# Altium schematic sheet Connectors.SchDoc
size OrCAD A
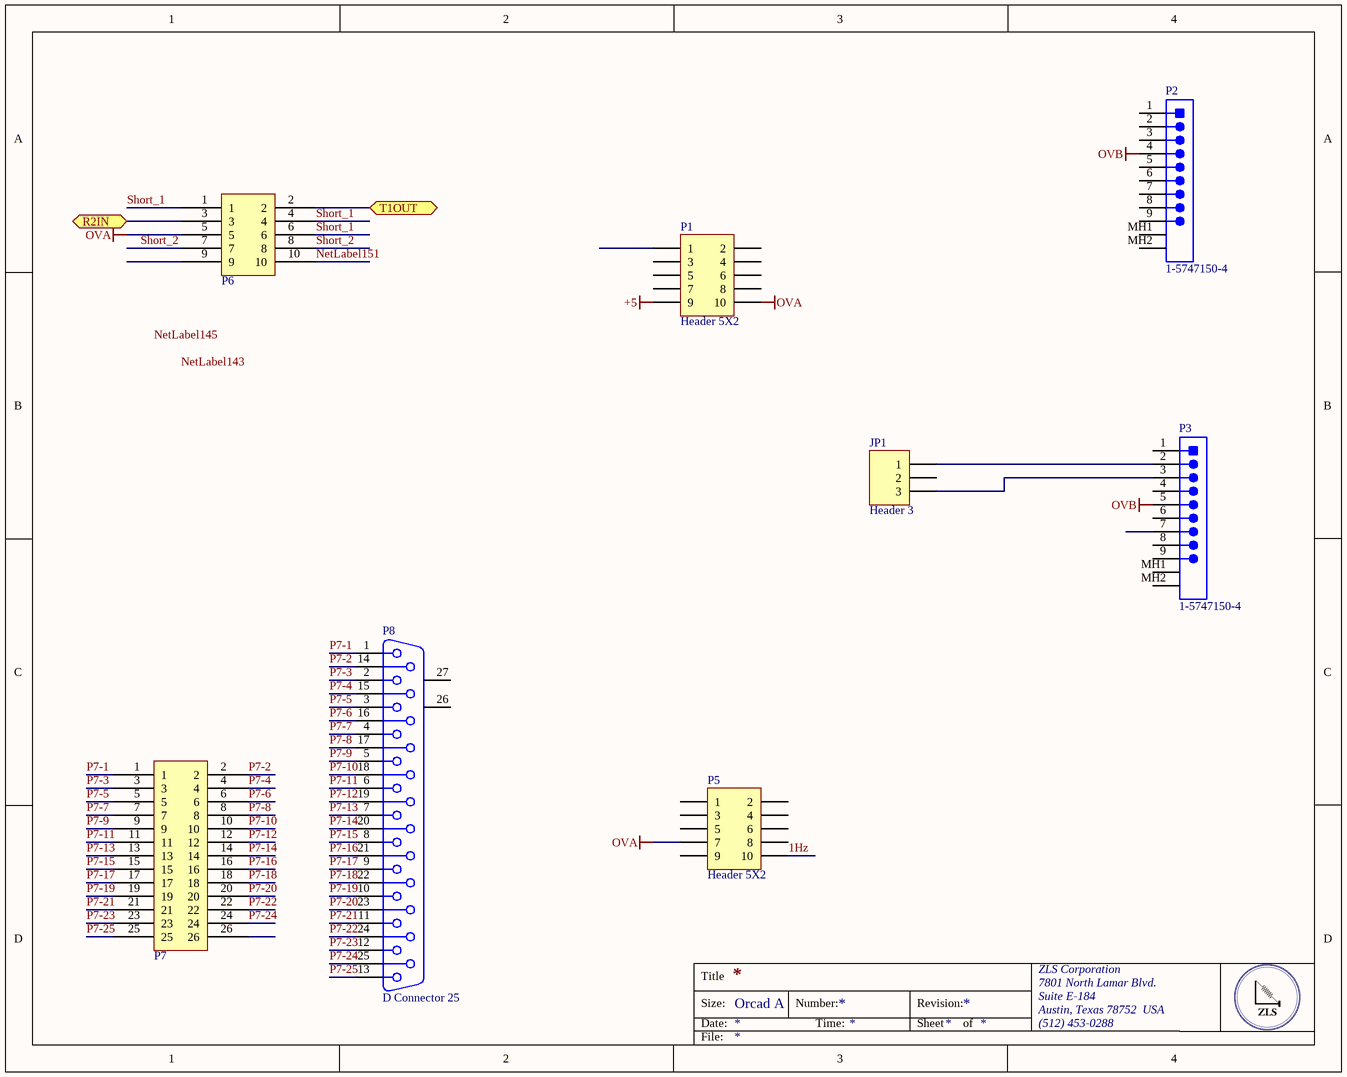
[diagram p0: Connectors.SchDoc]

## Parts
JP1  Header 3  [HDR1X3]
P1  Header 5X2  [HDR2X5]
P2  1-5747150-4  [TECO-1-5747150-4_V]
P3  1-5747150-4  [TECO-1-5747150-4_V]
P5  Header 5X2  [HDR2X5]
P6  STMM-105-01-G-D  [STMM-105-01-G-D]  (value not drawn)
P7  2.00 mm Shrouded Terminal Strip, Cable Mate  [STMM-113-01-G-D]  (value not drawn)
P8  D Connector 25  [DSUB1.385-2H25A]

## Ports
R2IN, T1OUT

## Nets
+5: P1.9
OVA: P1.10 P5.7 P6.5
OVB: P2.4 P3.5
1Hz: P5.10
NetLabel151: P6.10
P7-1: P7.1 P8.1
P7-2: P7.2 P8.14
P7-3: P7.3 P8.2
P7-4: P7.4 P8.15
P7-5: P7.5 P8.3
P7-6: P7.6 P8.16
P7-7: P7.7 P8.4
P7-8: P7.8 P8.17
P7-9: P7.9 P8.5
P7-10: P7.10 P8.18
P7-11: P7.11 P8.6
P7-12: P7.12 P8.19
P7-13: P7.13 P8.7
P7-14: P7.14 P8.20
P7-15: P7.15 P8.8
P7-16: P7.16 P8.21
P7-17: P7.17 P8.9
P7-18: P7.18 P8.22
P7-19: P7.19 P8.10
P7-20: P7.20 P8.23
P7-21: P7.21 P8.11
P7-22: P7.22 P8.24
P7-23: P7.23 P8.12
P7-24: P7.24 P8.25
P7-25: P7.25 P8.13
R2IN: P6.3 ; port R2IN
Short_1: P6.1 P6.4 P6.6
Short_2: P6.7 P6.8
T1OUT: P6.2 ; port T1OUT
NetJP1_1: JP1.1 P3.2
NetJP1_3: JP1.3 P3.3

Not connected (* = marked no-connect by the designer): JP1 2; P1 1 2 3 4 5 6 7 8; P2 1 2 3 5 6 7 8 9 MH1 MH2; P3 1 4 6 7 8 9 MH1 MH2; P5 1 2 3 4 5 6 8 9; P6 9; P7 26; P8 26(MH1) 27(MH2)

## Notes on the sheet
- Labels drawn without touching a wire or pin: NetLabel143, NetLabel145
- Title
- Size:
- Date:
- Orcad A
- Number:
- Time:
- Revision:
- Sheet
- of
- ZLS Corporation
- 7801 North Lamar Blvd.
- Suite E-184
- Austin, Texas 78752  USA
- (512) 453-0288
- File:

## Library data of the parts
JP1 = Header 3: Header, 3-Pin; LatestRevisionDate: 17-Jul-2002; LatestRevisionNote: Re-released for DXP Platform.; Publisher: Altium Limited
P1 P5 = Header 5X2: Header, 5-Pin, Dual row; LatestRevisionDate: 17-Jul-2002; LatestRevisionNote: Re-released for DXP Platform.; Publisher: Altium Limited
P2 P3 = CMP-2000-05406-1: D-SUB Connector, Standard, Pitch 1.37 mm, 9 Position, Height 12.16 mm, Tail Length 3.18 mm, RoHS, Tube; Manufacturer: TE Connectivity; Connector Type: Receptacle,FemaleSockets; Product Training Modules: AMPLIMITED-SubConnectors; Mating Products: AML09B-ND / -CONND-SUBPLUG9POSGOLD; Other Names: A32059; Number of Positions: 9; Flange Feature: MatingSide;FemaleScrewlock(4-40); Current Rating: 6A; Voltage Rating: 125V; Dynamic Catalog: AMPLIMITEHD-20Series; 3D Model: 1-5747150-4.pdf; Featured Product: AMPLIMITED-SubminiatureConnectors; Catalog Drawings: HD-20FrontMetalSide; Connector Style: D-Sub; Series: AMPLIMITEHD-20; Contact Finish: Gold; Shell Size, Connector Layout: 1(DE,E); Number of Rows: 2; Datasheet URL: http://www.produktinfo.conrad.com/datenblaetter/1200000-1299999/001281820-da-01-en-SUB_D_BUCHSENLEISTE_OHNE_SCHIRMFIEDERUNG.pdf; Contact Finish Thickness: 30µin(0.76µm); Color: Black; Mounting Type: ThroughHole; RoHS Information: 1-5747150-4StatementofCompliance; Datasheet Version: Rev. A1, 03/2011; Standard Package: 17; Shell Material, Finish: Steel,TinPlated; Manufacturer URL: http://www.te.com/; Category: Connectors,Interconnects; Termination: Solder; Housing Material: Polyester; Contact Type: Signal; Family: D-SubConnectors; Operating Temperature: -55degC~105degC
P6 = STMM-105-01-G-D: Manufacturer: SAMTEC; Supplier 1: Newark; Supplier Part Number 1: 67P3933; Manufacturer Part Number: STMM-105-01-G-D; Stock 1: 0; Pricing 1: 1=4.7, 10=4.11, 100=3.48, 500=2.98, 1000=2.6, 5000=2.3, 10000=2.19 (USD); ComponentLink1URL: https://webassistants.partcommunity.com/23d-libs/samtec/search/resolve.html?EMAIL=mysamtec@samtec.com&PN=HTSW-114-05-F-D; ComponentLink1Description: https://webassistants.partcommunity.com/23d-libs/samtec/search/resolve.html?EMAIL=mysamtec@samtec.com&PN=HTSW-114-05-F-D
P7 = STMM-113-01-G-D
P8 = D Connector 25: Receptacle Assembly, 25 Position, Right Angle; PackageDocument: U; Positions: 25; Published: 15-Jun-2001; LatestRevisionDate: 17-Jul-2002; LatestRevisionNote: Re-released for DXP Platform.; DatasheetDocument: 19-Mar-1999; PackageReference: 787202; Publisher: Altium Limited; Orientation: Right Angle; Gender: Receptacle